# EAGLE design Lab-3NANDx8 (EAGLE 7.3.0)

## Sheet 1 of 10
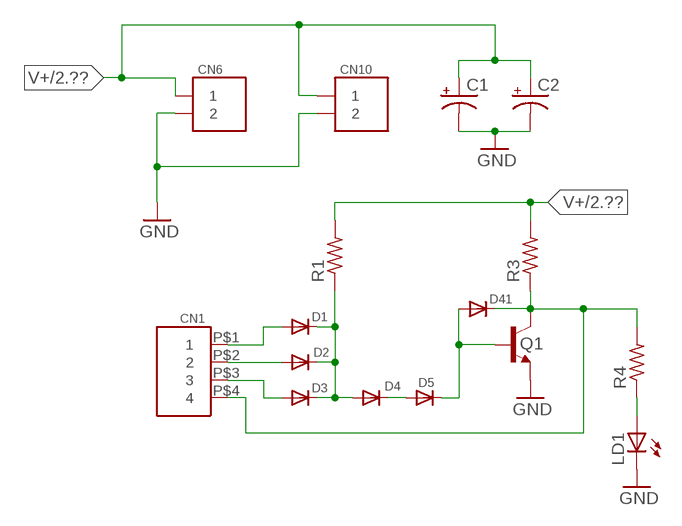
[diagram p0: schematic, sheet 1]

### Parts
C1  CPOL-USE2.5-5  [E2,5-5]
C2  CPOL-USE2.5-5  [E2,5-5]
CN1  HD4  [HD4]
CN6  HD2  [HD2]
CN10  HD2  [HD2]
D1  DIODE-6.3  [DO35-6.3]
D2  DIODE-6.3  [DO35-6.3]
D3  DIODE-6.3  [DO35-6.3]
D4  DIODE-6.3  [DO35-6.3]
D5  DIODE-6.3  [DO35-6.3]
D41  DIODE-7.6  [DO35-7.6]
LD1  LED3MM  [3MM]
Q1  2N3904-1  [TO92BH]
R1  R1/8-7.6MM  [R0125-7.6]
R3  R1/8-7.6MM  [R0125-7.6]
R4  R1/8-7.6MM  [R0125-7.6]

### Nets
GND: C1.- C2.- CN6.P$2 CN10.P$2 LD1.C Q1.1(E) ; also sheet 2,3,4,5,6,7,8,9,10
N$1: CN1.P$1 D1.A
N$2: CN1.P$2 D2.A
N$3: CN1.P$3 D3.A
N$4: D1.C D2.C D3.C D4.A R1.1
N$5: D4.C D5.A
N$6: D5.C D41.A Q1.2(B)
N$7: LD1.A R4.1
N$8: CN1.P$4 D41.C Q1.3(C) R3.1 R4.2
V+: C1.+ C2.+ CN6.P$1 CN10.P$1 R1.2 R3.2 ; also sheet 2,3,4,5,6,7,8,9,10

## Sheet 2 of 10
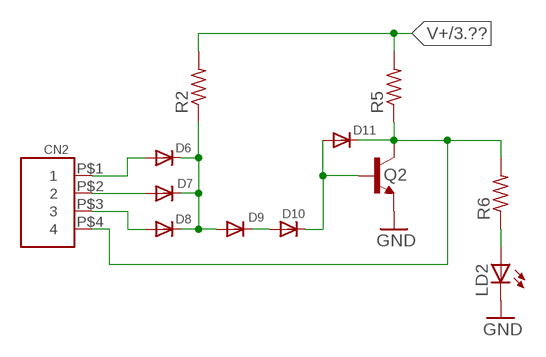
[diagram p1: schematic, sheet 2]

### Parts
CN2  HD4  [HD4]
D6  DIODE-6.3  [DO35-6.3]
D7  DIODE-6.3  [DO35-6.3]
D8  DIODE-6.3  [DO35-6.3]
D9  DIODE-6.3  [DO35-6.3]
D10  DIODE-6.3  [DO35-6.3]
D11  DIODE-7.6  [DO35-7.6]
LD2  LED3MM  [3MM]
Q2  2N3904-1  [TO92BH]
R2  R1/8-7.6MM  [R0125-7.6]
R5  R1/8-7.6MM  [R0125-7.6]
R6  R1/8-7.6MM  [R0125-7.6]

### Nets
GND: LD2.C Q2.1(E) ; also sheet 1,3,4,5,6,7,8,9,10
N$9: CN2.P$1 D6.A
N$10: CN2.P$2 D7.A
N$11: CN2.P$3 D8.A
N$12: D6.C D7.C D8.C D9.A R2.1
N$13: D9.C D10.A
N$14: D10.C D11.A Q2.2(B)
N$15: CN2.P$4 D11.C Q2.3(C) R5.1 R6.2
N$16: LD2.A R6.1
V+: R2.2 R5.2 ; also sheet 1,3,4,5,6,7,8,9,10

## Sheet 3 of 10
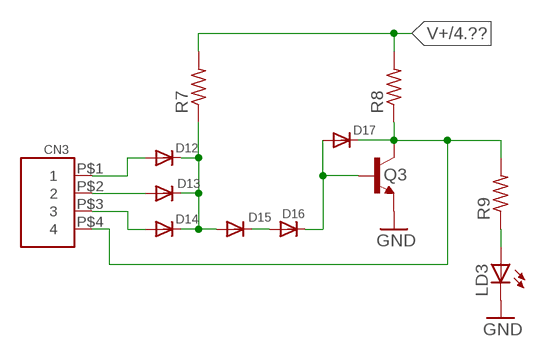
[diagram p2: schematic, sheet 3]

### Parts
CN3  HD4  [HD4]
D12  DIODE-6.3  [DO35-6.3]
D13  DIODE-6.3  [DO35-6.3]
D14  DIODE-6.3  [DO35-6.3]
D15  DIODE-6.3  [DO35-6.3]
D16  DIODE-6.3  [DO35-6.3]
D17  DIODE-7.6  [DO35-7.6]
LD3  LED3MM  [3MM]
Q3  2N3904-1  [TO92BH]
R7  R1/8-7.6MM  [R0125-7.6]
R8  R1/8-7.6MM  [R0125-7.6]
R9  R1/8-7.6MM  [R0125-7.6]

### Nets
GND: LD3.C Q3.1(E) ; also sheet 1,2,4,5,6,7,8,9,10
N$17: CN3.P$1 D12.A
N$18: CN3.P$2 D13.A
N$19: CN3.P$3 D14.A
N$20: D12.C D13.C D14.C D15.A R7.1
N$21: D15.C D16.A
N$22: D16.C D17.A Q3.2(B)
N$23: CN3.P$4 D17.C Q3.3(C) R8.1 R9.2
N$24: LD3.A R9.1
V+: R7.2 R8.2 ; also sheet 1,2,4,5,6,7,8,9,10

## Sheet 4 of 10
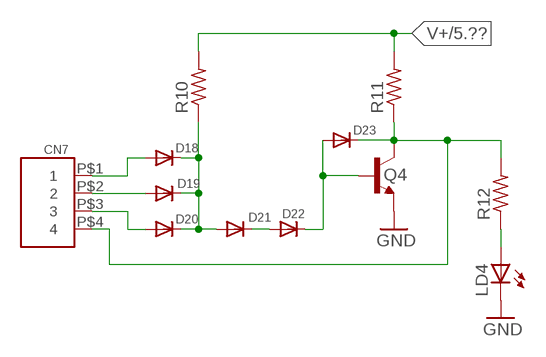
[diagram p3: schematic, sheet 4]

### Parts
CN7  HD4  [HD4]
D18  DIODE-6.3  [DO35-6.3]
D19  DIODE-6.3  [DO35-6.3]
D20  DIODE-6.3  [DO35-6.3]
D21  DIODE-6.3  [DO35-6.3]
D22  DIODE-6.3  [DO35-6.3]
D23  DIODE-7.6  [DO35-7.6]
LD4  LED3MM  [3MM]
Q4  2N3904-1  [TO92BH]
R10  R1/8-7.6MM  [R0125-7.6]
R11  R1/8-7.6MM  [R0125-7.6]
R12  R1/8-7.6MM  [R0125-7.6]

### Nets
GND: LD4.C Q4.1(E) ; also sheet 1,2,3,5,6,7,8,9,10
N$25: CN7.P$1 D18.A
N$26: CN7.P$2 D19.A
N$27: CN7.P$3 D20.A
N$28: D18.C D19.C D20.C D21.A R10.1
N$29: D21.C D22.A
N$30: D22.C D23.A Q4.2(B)
N$31: CN7.P$4 D23.C Q4.3(C) R11.1 R12.2
N$32: LD4.A R12.1
V+: R10.2 R11.2 ; also sheet 1,2,3,5,6,7,8,9,10

## Sheet 5 of 10
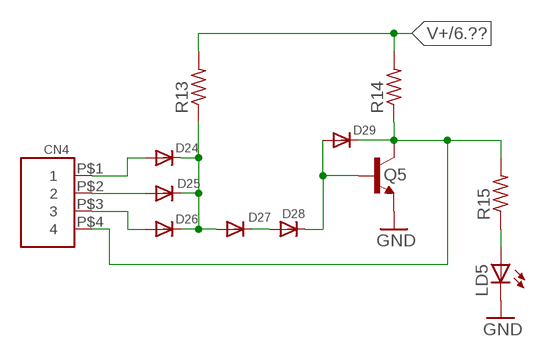
[diagram p4: schematic, sheet 5]

### Parts
CN4  HD4  [HD4]
D24  DIODE-6.3  [DO35-6.3]
D25  DIODE-6.3  [DO35-6.3]
D26  DIODE-6.3  [DO35-6.3]
D27  DIODE-6.3  [DO35-6.3]
D28  DIODE-6.3  [DO35-6.3]
D29  DIODE-7.6  [DO35-7.6]
LD5  LED3MM  [3MM]
Q5  2N3904-1  [TO92BH]
R13  R1/8-7.6MM  [R0125-7.6]
R14  R1/8-7.6MM  [R0125-7.6]
R15  R1/8-7.6MM  [R0125-7.6]

### Nets
GND: LD5.C Q5.1(E) ; also sheet 1,2,3,4,6,7,8,9,10
N$33: CN4.P$1 D24.A
N$34: CN4.P$2 D25.A
N$35: CN4.P$3 D26.A
N$36: D24.C D25.C D26.C D27.A R13.1
N$37: D27.C D28.A
N$38: D28.C D29.A Q5.2(B)
N$39: CN4.P$4 D29.C Q5.3(C) R14.1 R15.2
N$40: LD5.A R15.1
V+: R13.2 R14.2 ; also sheet 1,2,3,4,6,7,8,9,10

## Sheet 6 of 10
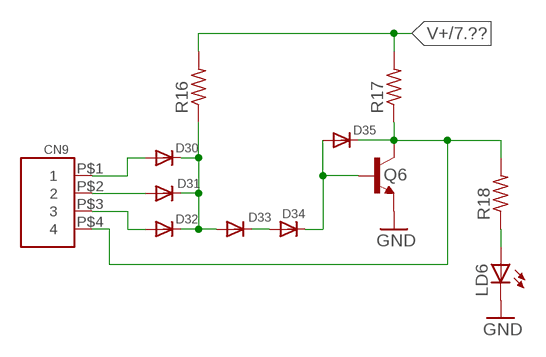
[diagram p5: schematic, sheet 6]

### Parts
CN9  HD4  [HD4]
D30  DIODE-6.3  [DO35-6.3]
D31  DIODE-6.3  [DO35-6.3]
D32  DIODE-6.3  [DO35-6.3]
D33  DIODE-6.3  [DO35-6.3]
D34  DIODE-6.3  [DO35-6.3]
D35  DIODE-7.6  [DO35-7.6]
LD6  LED3MM  [3MM]
Q6  2N3904-1  [TO92BH]
R16  R1/8-7.6MM  [R0125-7.6]
R17  R1/8-7.6MM  [R0125-7.6]
R18  R1/8-7.6MM  [R0125-7.6]

### Nets
GND: LD6.C Q6.1(E) ; also sheet 1,2,3,4,5,7,8,9,10
N$41: CN9.P$1 D30.A
N$42: CN9.P$2 D31.A
N$43: CN9.P$3 D32.A
N$44: D30.C D31.C D32.C D33.A R16.1
N$45: D33.C D34.A
N$46: D34.C D35.A Q6.2(B)
N$47: CN9.P$4 D35.C Q6.3(C) R17.1 R18.2
N$48: LD6.A R18.1
V+: R16.2 R17.2 ; also sheet 1,2,3,4,5,7,8,9,10

## Sheet 7 of 10
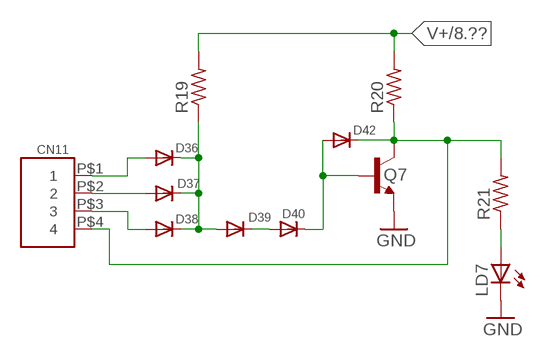
[diagram p6: schematic, sheet 7]

### Parts
CN11  HD4  [HD4]
D36  DIODE-6.3  [DO35-6.3]
D37  DIODE-6.3  [DO35-6.3]
D38  DIODE-6.3  [DO35-6.3]
D39  DIODE-6.3  [DO35-6.3]
D40  DIODE-6.3  [DO35-6.3]
D42  DIODE-7.6  [DO35-7.6]
LD7  LED3MM  [3MM]
Q7  2N3904-1  [TO92BH]
R19  R1/8-7.6MM  [R0125-7.6]
R20  R1/8-7.6MM  [R0125-7.6]
R21  R1/8-7.6MM  [R0125-7.6]

### Nets
GND: LD7.C Q7.1(E) ; also sheet 1,2,3,4,5,6,8,9,10
N$49: CN11.P$1 D36.A
N$50: CN11.P$2 D37.A
N$51: CN11.P$3 D38.A
N$52: D36.C D37.C D38.C D39.A R19.1
N$53: D39.C D40.A
N$54: D40.C D42.A Q7.2(B)
N$55: CN11.P$4 D42.C Q7.3(C) R20.1 R21.2
N$56: LD7.A R21.1
V+: R19.2 R20.2 ; also sheet 1,2,3,4,5,6,8,9,10

## Sheet 8 of 10
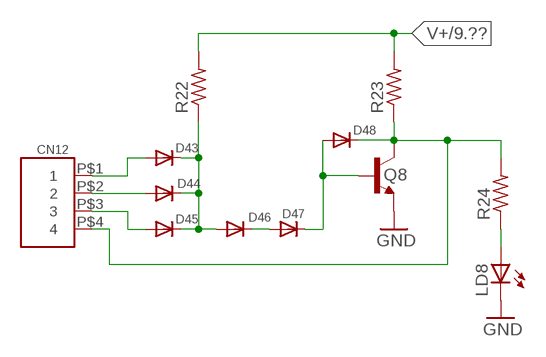
[diagram p7: schematic, sheet 8]

### Parts
CN12  HD4  [HD4]
D43  DIODE-6.3  [DO35-6.3]
D44  DIODE-6.3  [DO35-6.3]
D45  DIODE-6.3  [DO35-6.3]
D46  DIODE-6.3  [DO35-6.3]
D47  DIODE-6.3  [DO35-6.3]
D48  DIODE-7.6  [DO35-7.6]
LD8  LED3MM  [3MM]
Q8  2N3904-1  [TO92BH]
R22  R1/8-7.6MM  [R0125-7.6]
R23  R1/8-7.6MM  [R0125-7.6]
R24  R1/8-7.6MM  [R0125-7.6]

### Nets
GND: LD8.C Q8.1(E) ; also sheet 1,2,3,4,5,6,7,9,10
N$57: CN12.P$1 D43.A
N$58: CN12.P$2 D44.A
N$59: CN12.P$3 D45.A
N$60: D43.C D44.C D45.C D46.A R22.1
N$61: D46.C D47.A
N$62: D47.C D48.A Q8.2(B)
N$63: CN12.P$4 D48.C Q8.3(C) R23.1 R24.2
N$64: LD8.A R24.1
V+: R22.2 R23.2 ; also sheet 1,2,3,4,5,6,7,9,10

## Sheet 9 of 10
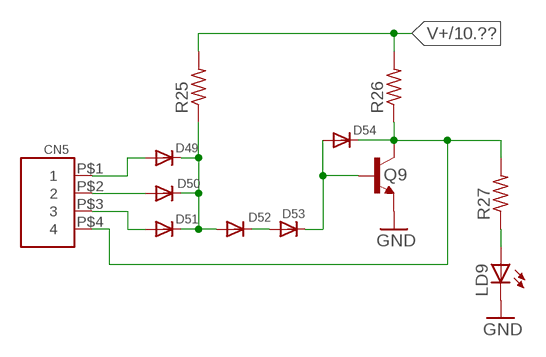
[diagram p8: schematic, sheet 9]

### Parts
CN5  HD4  [HD4]
D49  DIODE-6.3  [DO35-6.3]
D50  DIODE-6.3  [DO35-6.3]
D51  DIODE-6.3  [DO35-6.3]
D52  DIODE-6.3  [DO35-6.3]
D53  DIODE-6.3  [DO35-6.3]
D54  DIODE-7.6  [DO35-7.6]
LD9  LED3MM  [3MM]
Q9  2N3904-1  [TO92BH]
R25  R1/8-7.6MM  [R0125-7.6]
R26  R1/8-7.6MM  [R0125-7.6]
R27  R1/8-7.6MM  [R0125-7.6]

### Nets
GND: LD9.C Q9.1(E) ; also sheet 1,2,3,4,5,6,7,8,10
N$65: CN5.P$1 D49.A
N$66: CN5.P$2 D50.A
N$67: CN5.P$3 D51.A
N$68: D49.C D50.C D51.C D52.A R25.1
N$69: D52.C D53.A
N$70: D53.C D54.A Q9.2(B)
N$71: CN5.P$4 D54.C Q9.3(C) R26.1 R27.2
N$72: LD9.A R27.1
V+: R25.2 R26.2 ; also sheet 1,2,3,4,5,6,7,8,10

## Sheet 10 of 10
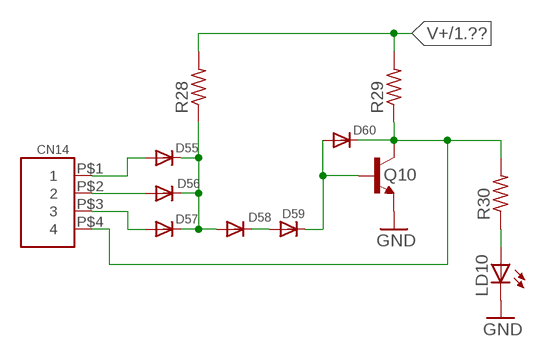
[diagram p9: schematic, sheet 10]

### Parts
CN14  HD4  [HD4]
D55  DIODE-6.3  [DO35-6.3]
D56  DIODE-6.3  [DO35-6.3]
D57  DIODE-6.3  [DO35-6.3]
D58  DIODE-6.3  [DO35-6.3]
D59  DIODE-6.3  [DO35-6.3]
D60  DIODE-7.6  [DO35-7.6]
LD10  LED3MM  [3MM]
Q10  2N3904-1  [TO92BH]
R28  R1/8-7.6MM  [R0125-7.6]
R29  R1/8-7.6MM  [R0125-7.6]
R30  R1/8-7.6MM  [R0125-7.6]

### Nets
GND: LD10.C Q10.1(E) ; also sheet 1,2,3,4,5,6,7,8,9
N$73: CN14.P$1 D55.A
N$74: CN14.P$2 D56.A
N$75: CN14.P$3 D57.A
N$76: D55.C D56.C D57.C D58.A R28.1
N$77: D58.C D59.A
N$78: D59.C D60.A Q10.2(B)
N$79: CN14.P$4 D60.C Q10.3(C) R29.1 R30.2
N$80: LD10.A R30.1
V+: R28.2 R29.2 ; also sheet 1,2,3,4,5,6,7,8,9

## Library data of the parts
C1 C2 = adafruit:CPOL-US: POLARIZED CAPACITOR, American symbol
CN1-CN5 CN7 CN9 CN11 CN12 CN14 = SmallRoomLabs_ConSwitch:HD4
CN6 CN10 = SmallRoomLabs_ConSwitch:HD2
D1-D60 = SmallRoomLabs_Semiconductor:DIODE
LD1-LD10 = SmallRoomLabs_Led:LED
Q1-Q10 = SmallRoomLabs_Semiconductor:2N3904
R1-R30 = SmallRoomLabs_Discrete:R

## Net classes
0 default: width 0.203 mm, drill 0.305 mm, clearance 0.203 mm

## Board
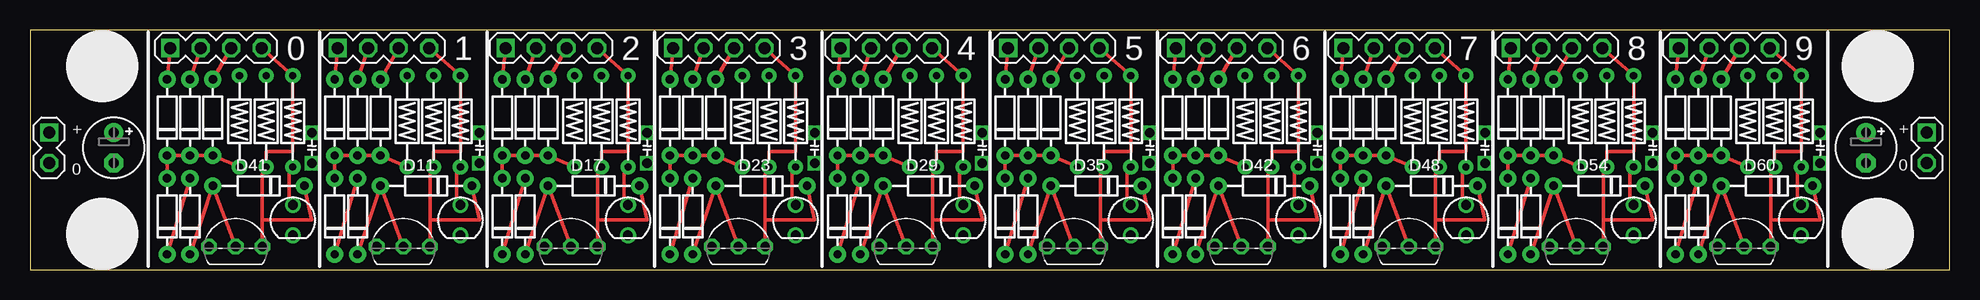
[diagram p10: board, top side]
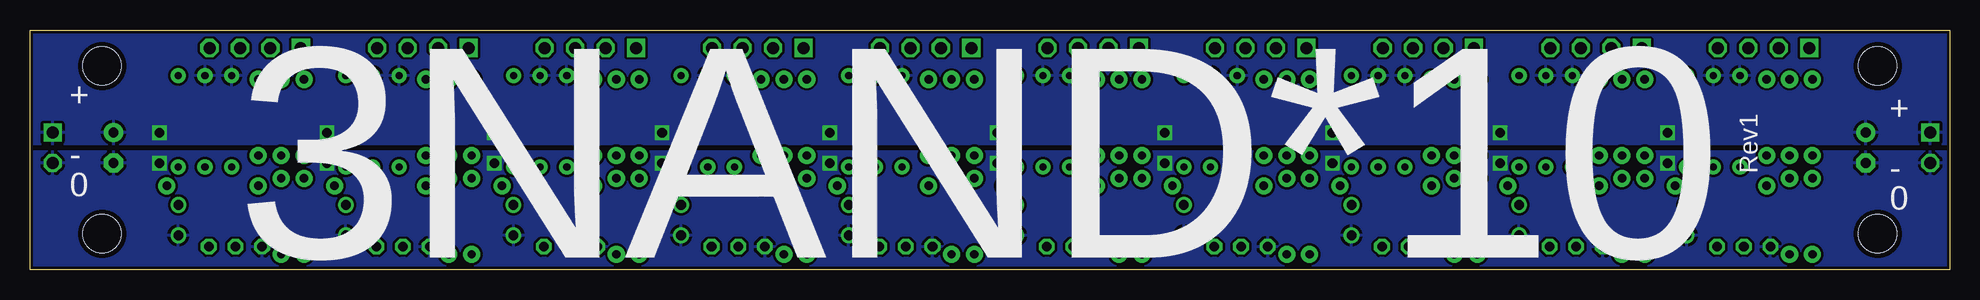
[diagram p11: board, bottom side, seen from below]

Size 160 x 20 mm. Coordinates in mm from the lower left corner, seen from the top.
Outline: 0,0 160,0 160,20 0,20 0,0
Copper layers (1*16): Top 0.035mm / dielectric 1.5mm / Bottom 0.035mm
Design rules "dirt_cheap_dirty_boards.v1": minimum track width 5mil, minimum drill 12mil, track to track 5mil, track to pad 5mil, pad to pad 5mil, via to via 5mil, smd to smd 0mil, copper to edge 10mil, drill to drill 10mil, minimum pad ring 10mil, minimum via ring 6mil, stop-mask expansion 2mil, vias tented up to drill 25mil, thermal gap 10mil
Holes 3.2 mm at 6,3 6,17 154,3 154,17
tRestrict: area 4,15 to 8,19; area 4,1 to 8,5; area 152,1 to 156,5; area 152,15 to 156,19
bRestrict: area 152,15 to 156,19; area 152,1 to 156,5; area 4,15 to 8,19; area 4,1 to 8,5

### Footprints (pad centres in the part's own frame; a part is rotated, then mirrored left to right if it is on the bottom)
E2,5-5 = drill 0.813 pad 1.6: + -1.27,0 | drill 0.813 pad 1.6 octagon: - 1.27,0
HD4 = drill 1 square: P$1 -3.81,0 | drill 1 octagon: P$2 -1.27,0; P$3 1.27,0; P$4 3.81,0
HD2 = drill 1 square: P$1 -1.27,0 | drill 1 octagon: P$2 1.27,0
DO35-6.3 = drill 0.7 pad 1.422: A -3.175,0; C 3.175,0
DO35-7.6 = drill 0.7 pad 1.422: A -3.81,0; C 3.81,0
3MM = drill 0.8: A -1.27,0; C 1.27,0
TO92BH = drill 0.8 octagon: 1 -2.223,0; 2 0,0; 3 2.223,0
R0125-7.6 = drill 0.6 pad 1.27: 1 -3.81,0; 2 3.81,0

### Placement (x,y rotation side)
C1  6.99,10.16 270 top
C2  153.03,10.16 270 top
CN1  15.5,18.5 0 top
CN2  29.47,18.5 0 top
CN3  43.44,18.5 0 top
CN4  71.38,18.5 0 top
CN5  127.26,18.5 0 top
CN6  1.59,10.16 270 top
CN7  57.41,18.5 0 top
CN9  85.35,18.5 0 top
CN10  158.12,10.16 270 top
CN11  99.32,18.5 0 top
CN12  113.29,18.5 0 top
CN14  141.23,18.5 0 top
D1  11.43,12.7 270 top
D2  13.34,12.7 270 top
D3  15.24,12.7 270 top
D4  11.43,4.45 270 top
D5  13.34,4.45 270 top
D6  25.4,12.7 270 top
D7  27.3,12.7 270 top
D8  29.21,12.7 270 top
D9  25.4,4.45 270 top
D10  27.3,4.45 270 top
D11  33.02,6.99 0 top
D12  39.37,12.7 270 top
D13  41.27,12.7 270 top
D14  43.18,12.7 270 top
D15  39.37,4.45 270 top
D16  41.27,4.45 270 top
D17  46.99,6.99 0 top
D18  53.34,12.7 270 top
D19  55.24,12.7 270 top
D20  57.15,12.7 270 top
D21  53.34,4.45 270 top
D22  55.24,4.45 270 top
D23  60.96,6.99 0 top
D24  67.31,12.7 270 top
D25  69.22,12.7 270 top
D26  71.12,12.7 270 top
D27  67.31,4.45 270 top
D28  69.22,4.45 270 top
D29  74.93,6.99 0 top
D30  81.28,12.7 270 top
D31  83.19,12.7 270 top
D32  85.09,12.7 270 top
D33  81.28,4.45 270 top
D34  83.19,4.45 270 top
D35  88.9,6.99 0 top
D36  95.25,12.7 270 top
D37  97.16,12.7 270 top
D38  99.06,12.7 270 top
D39  95.25,4.45 270 top
D40  97.16,4.45 270 top
D41  19.05,6.99 0 top
D42  102.87,6.99 0 top
D43  109.22,12.7 270 top
D44  111.12,12.7 270 top
D45  113.03,12.7 270 top
D46  109.22,4.45 270 top
D47  111.12,4.45 270 top
D48  116.84,6.99 0 top
D49  123.19,12.7 270 top
D50  125.09,12.7 270 top
D51  127,12.7 270 top
D52  123.19,4.45 270 top
D53  125.09,4.45 270 top
D54  130.81,6.99 0 top
D55  137.16,12.7 270 top
D56  139.06,12.7 270 top
D57  140.97,12.7 270 top
D58  137.16,4.45 270 top
D59  139.06,4.45 270 top
D60  144.78,6.99 0 top
LD1  21.91,4.13 270 top
LD2  35.88,4.13 270 top
LD3  49.85,4.13 270 top
LD4  63.82,4.13 270 top
LD5  77.79,4.13 270 top
LD6  91.76,4.13 270 top
LD7  105.73,4.13 270 top
LD8  119.7,4.13 270 top
LD9  133.67,4.13 270 top
LD10  147.64,4.13 270 top
Q1  17.14,1.91 0 top
Q2  31.11,1.91 0 top
Q3  45.09,1.91 0 top
Q4  59.05,1.91 0 top
Q5  73.03,1.91 0 top
Q6  87,1.91 0 top
Q7  100.97,1.91 0 top
Q8  114.94,1.91 0 top
Q9  128.91,1.91 0 top
Q10  142.88,1.91 0 top
R1  17.46,12.38 90 top
R2  31.43,12.38 90 top
R3  19.68,12.38 90 top
R4  21.91,12.38 90 top
R5  33.66,12.38 90 top
R6  35.88,12.38 90 top
R7  45.4,12.38 90 top
R8  47.62,12.38 90 top
R9  49.85,12.38 90 top
R10  59.37,12.38 90 top
R11  61.59,12.38 90 top
R12  63.82,12.38 90 top
R13  73.34,12.38 90 top
R14  75.56,12.38 90 top
R15  77.79,12.38 90 top
R16  87.31,12.38 90 top
R17  89.53,12.38 90 top
R18  91.76,12.38 90 top
R19  101.28,12.38 90 top
R20  103.5,12.38 90 top
R21  105.73,12.38 90 top
R22  115.25,12.38 90 top
R23  117.47,12.38 90 top
R24  119.7,12.38 90 top
R25  129.22,12.38 90 top
R26  131.44,12.38 90 top
R27  133.67,12.38 90 top
R28  143.19,12.38 90 top
R29  145.41,12.38 90 top
R30  147.64,12.38 90 top

### Tracks (layer width: path | path; a pad name or v marks a point on that pad's centre or on a via)
GND  (via drill 0.8)
  other vias: 23.5,8.89 37.47,8.89 51.44,8.89 65.41,8.89 79.38,8.89 93.34,8.89 107.31,8.89 121.28,8.89 135.25,8.89 149.22,8.89
  pour Bottom: 0,9.84 0,0 160.02,0 160.02,9.84
N$1
  Top 0.305: CN1.P$1 D1.A
N$2
  Top 0.305: D2.A CN1.P$2
N$3
  Top 0.305: D3.A CN1.P$3
N$4
  Top 0.305: D4.A D1.C D2.C D3.C R1.1
N$5
  Top 0.305: D4.C D5.A
N$6
  Top 0.305: D5.C D41.A Q1.2
N$7
  Top 0.305: R4.1 21.59,8.26 21.59,5.71 LD1.A
N$8
  Top 0.305: Q1.3 19.37,4.13 | 19.37,4.13 19.37,7.94 R3.1 19.68,9.84 21.91,9.84 R4.2 CN1.P$4 | D41.C 23.5,4.13 19.37,4.13
N$9
  Top 0.305: CN2.P$1 D6.A
N$10
  Top 0.305: D7.A CN2.P$2
N$11
  Top 0.305: D8.A CN2.P$3
N$12
  Top 0.305: D9.A D6.C D7.C D8.C R2.1
N$13
  Top 0.305: D9.C D10.A
N$14
  Top 0.305: D10.C D11.A Q2.2
N$15
  Top 0.305: Q2.3 33.34,4.13 | 33.34,4.13 33.34,7.94 R5.1 33.66,9.84 35.88,9.84 R6.2 CN2.P$4 | D11.C 37.47,4.13 33.34,4.13
N$16
  Top 0.305: R6.1 35.56,8.26 35.56,5.71 LD2.A
N$17
  Top 0.305: CN3.P$1 D12.A
N$18
  Top 0.305: D13.A CN3.P$2
N$19
  Top 0.305: D14.A CN3.P$3
N$20
  Top 0.305: D15.A D12.C D13.C D14.C R7.1
N$21
  Top 0.305: D15.C D16.A
N$22
  Top 0.305: D16.C D17.A Q3.2
N$23
  Top 0.305: Q3.3 47.31,4.13 | 47.31,4.13 47.31,7.94 R8.1 47.62,9.84 49.85,9.84 R9.2 CN3.P$4 | D17.C 51.44,4.13 47.31,4.13
N$24
  Top 0.305: R9.1 49.53,8.26 49.53,5.71 LD3.A
N$25
  Top 0.305: CN7.P$1 D18.A
N$26
  Top 0.305: D19.A CN7.P$2
N$27
  Top 0.305: D20.A CN7.P$3
N$28
  Top 0.305: D21.A D18.C D19.C D20.C R10.1
N$29
  Top 0.305: D21.C D22.A
N$30
  Top 0.305: D22.C D23.A Q4.2
N$31
  Top 0.305: Q4.3 61.28,4.13 | 61.28,4.13 61.28,7.94 R11.1 61.59,9.84 63.82,9.84 R12.2 CN7.P$4 | D23.C 65.41,4.13 61.28,4.13
N$32
  Top 0.305: R12.1 63.5,8.26 63.5,5.71 LD4.A
N$33
  Top 0.305: CN4.P$1 D24.A
N$34
  Top 0.305: D25.A CN4.P$2
N$35
  Top 0.305: D26.A CN4.P$3
N$36
  Top 0.305: D27.A D24.C D25.C D26.C R13.1
N$37
  Top 0.305: D27.C D28.A
N$38
  Top 0.305: D28.C D29.A Q5.2
N$39
  Top 0.305: Q5.3 75.25,4.13 | 75.25,4.13 75.25,7.94 R14.1 75.56,9.84 77.79,9.84 R15.2 CN4.P$4 | D29.C 79.38,4.13 75.25,4.13
N$40
  Top 0.305: R15.1 77.47,8.26 77.47,5.71 LD5.A
N$41
  Top 0.305: CN9.P$1 D30.A
N$42
  Top 0.305: D31.A CN9.P$2
N$43
  Top 0.305: D32.A CN9.P$3
N$44
  Top 0.305: D33.A D30.C D31.C D32.C R16.1
N$45
  Top 0.305: D33.C D34.A
N$46
  Top 0.305: D34.C D35.A Q6.2
N$47
  Top 0.305: Q6.3 89.22,4.13 | 89.22,4.13 89.22,7.94 R17.1 89.53,9.84 91.76,9.84 R18.2 CN9.P$4 | D35.C 93.34,4.13 89.22,4.13
N$48
  Top 0.305: R18.1 91.44,8.26 91.44,5.71 LD6.A
N$49
  Top 0.305: CN11.P$1 D36.A
N$50
  Top 0.305: D37.A CN11.P$2
N$51
  Top 0.305: D38.A CN11.P$3
N$52
  Top 0.305: D39.A D36.C D37.C D38.C R19.1
N$53
  Top 0.305: D39.C D40.A
N$54
  Top 0.305: D40.C D42.A Q7.2
N$55
  Top 0.305: Q7.3 103.19,4.13 | 103.19,4.13 103.19,7.94 R20.1 103.5,9.84 105.73,9.84 R21.2 CN11.P$4 | D42.C 107.31,4.13 103.19,4.13
N$56
  Top 0.305: R21.1 105.41,8.26 105.41,5.71 LD7.A
N$57
  Top 0.305: CN12.P$1 D43.A
N$58
  Top 0.305: D44.A CN12.P$2
N$59
  Top 0.305: D45.A CN12.P$3
N$60
  Top 0.305: D46.A D43.C D44.C D45.C R22.1
N$61
  Top 0.305: D46.C D47.A
N$62
  Top 0.305: D47.C D48.A Q8.2
N$63
  Top 0.305: Q8.3 117.16,4.13 | 117.16,4.13 117.16,7.94 R23.1 117.47,9.84 119.7,9.84 R24.2 CN12.P$4 | D48.C 121.28,4.13 117.16,4.13
N$64
  Top 0.305: R24.1 119.38,8.26 119.38,5.71 LD8.A
N$65
  Top 0.305: CN5.P$1 D49.A
N$66
  Top 0.305: D50.A CN5.P$2
N$67
  Top 0.305: D51.A CN5.P$3
N$68
  Top 0.305: D52.A D49.C D50.C D51.C R25.1
N$69
  Top 0.305: D52.C D53.A
N$70
  Top 0.305: D53.C D54.A Q9.2
N$71
  Top 0.305: Q9.3 131.13,4.13 | 131.13,4.13 131.13,7.94 R26.1 131.44,9.84 133.67,9.84 R27.2 CN5.P$4 | D54.C 135.25,4.13 131.13,4.13
N$72
  Top 0.305: R27.1 133.35,8.26 133.35,5.71 LD9.A
N$73
  Top 0.305: CN14.P$1 D55.A
N$74
  Top 0.305: D56.A CN14.P$2
N$75
  Top 0.305: D57.A CN14.P$3
N$76
  Top 0.305: D58.A D55.C D56.C D57.C R28.1
N$77
  Top 0.305: D58.C D59.A
N$78
  Top 0.305: D59.C D60.A Q10.2
N$79
  Top 0.305: Q10.3 145.1,4.13 | 145.1,4.13 145.1,7.94 R29.1 145.41,9.84 147.64,9.84 R30.2 CN14.P$4 | D60.C 149.22,4.13 145.1,4.13
N$80
  Top 0.305: R30.1 147.32,8.26 147.32,5.71 LD10.A
V+  (via drill 0.8)
  other vias: 23.5,11.43 37.47,11.43 51.44,11.43 79.38,11.43 93.34,11.43 107.31,11.43 121.28,11.43 135.25,11.43 149.22,11.43 65.41,11.43
  pour Bottom: 0,20 0,10.48 160.02,10.48 160.02,20

### Text on the board
tPlace: 0 | 1 | 2 | 3 | 4 | 5 | 6 | 7 | 8 | 9 | + | + | 0 | 0
bPlace: + | Rev1 | + | - | - | 0 | 0 | 3NAND*10